# EAGLE design sensor (EAGLE 9.4.2)

## Sheet 1 of 2
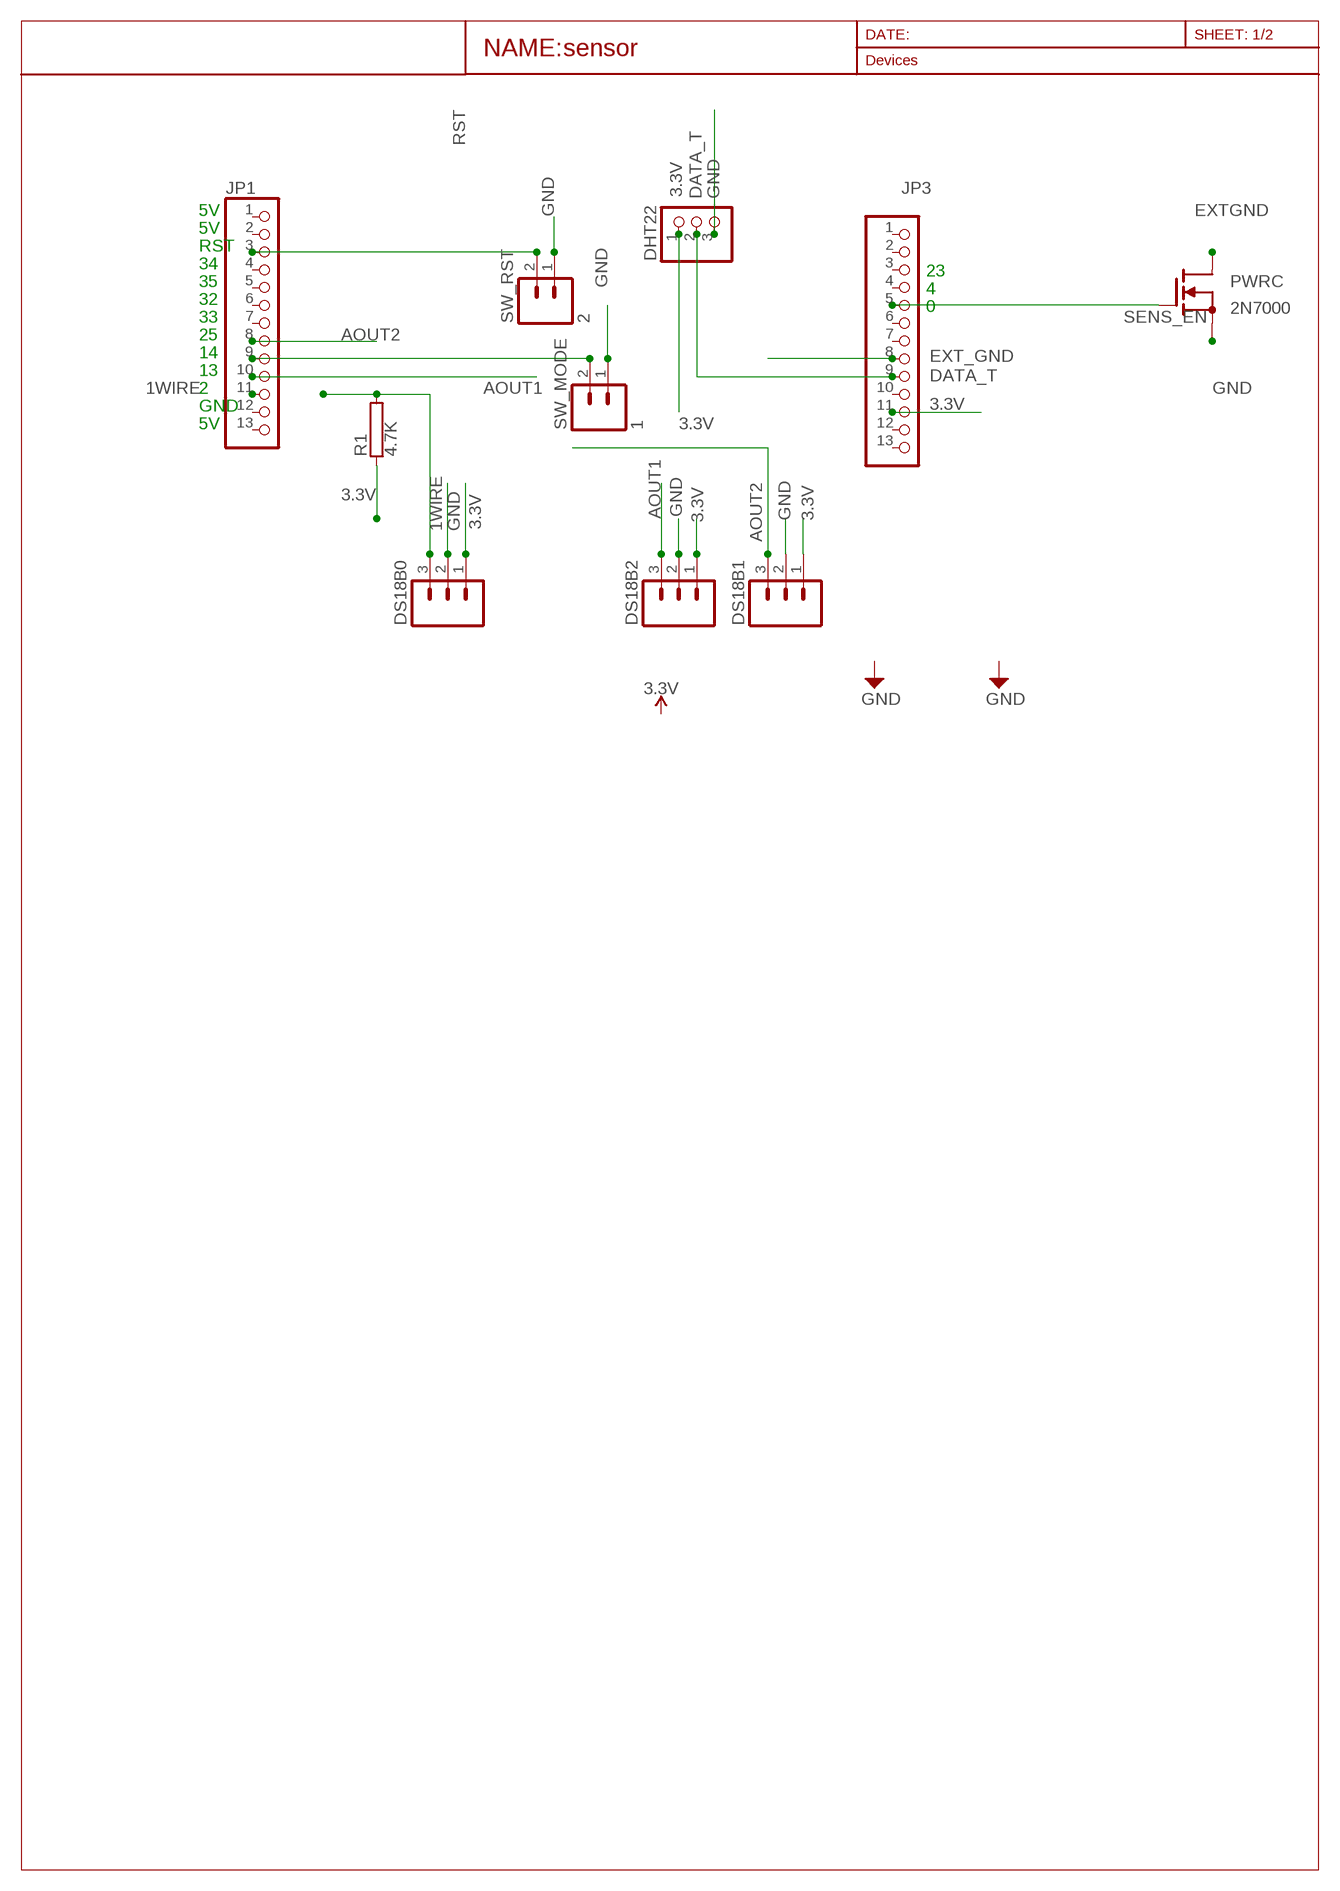
[diagram p0: schematic, sheet 1]

### Parts
DHT22  PINHD-1X3  [1X03]
DS18B0  M03  [03P]
DS18B1  M03  [03P]
DS18B2  M03  [03P]
JP1  PINHD-1X13  [1X13]
JP3  PINHD-1X13  [1X13]
PWRC  2N7000  [TO92]
R1  4.7K  RAC01  [AC01]
SW_MODE  1  M02  [02P]
SW_RST  2  M02  [02P]

### Nets
1WIRE: DS18B0.3 JP1.11 R1.2
3.3V: DHT22.1 DS18B0.1 DS18B1.1 DS18B2.1 JP3.11 R1.1
AOUT1: DS18B2.3 JP1.10
AOUT2: DS18B1.3 JP1.8
DATA_T: DHT22.2 JP3.9
EXT_GND: JP3.8
EXTGND: PWRC.E(D)
GND: DHT22.3 DS18B0.2 DS18B1.2 DS18B2.2 PWRC.C(S) SW_MODE.1 SW_RST.1
MODE: JP1.9 SW_MODE.2
RST: JP1.3 SW_RST.2
SENS_EN: JP3.5 PWRC.B(G)
Unconnected: JP1.1 JP1.2 JP1.4 JP1.5 JP1.6 JP1.7 JP1.12 JP1.13 JP3.1 JP3.2 JP3.3 JP3.4 JP3.6 JP3.7 JP3.10 JP3.12 JP3.13

### Notes on the sheet
- 5V
- 5V
- RST
- 34
- 23
- 35
- 4
- 32
- 0
- 33
- 25
- 14
- 13
- 2
- GND
- 5V

## Sheet 2 of 2

## Library data of the parts
DHT22 = adafruit:PINHD-1X3: PIN HEADER
DS18B0 DS18B1 DS18B2 = con-amp-quick:M03: AMP QUICK CONNECTOR; OC_FARNELL: unknown; OC_NEWARK: unknown
JP1 JP3 = adafruit:PINHD-1X13: PIN HEADER
PWRC = 2N7000:2N7000; AVAILABILITY: Unavailable; DESCRIPTION: MOSFETs- Power and Small Signal 60V 200mA N-Channel No-Cancel/No-Return; MF: STMicroelectronics; MP: 2N7000; PACKAGE: TO-92 ON Semiconductor; PRICE: None
R1 = resistor-power:R: Power Resitor; OC_FARNELL: unknown; OC_NEWARK: unknown
SW_MODE SW_RST = con-amp-quick:M02: AMP QUICK CONNECTOR; OC_FARNELL: unknown; OC_NEWARK: unknown

## Module SWITCHES
Ports: 

### Library data of the parts

## Module POWER
Ports: VCC(io) 3.3V(io) GND(io) ENABLE(io)

### Library data of the parts

## Board
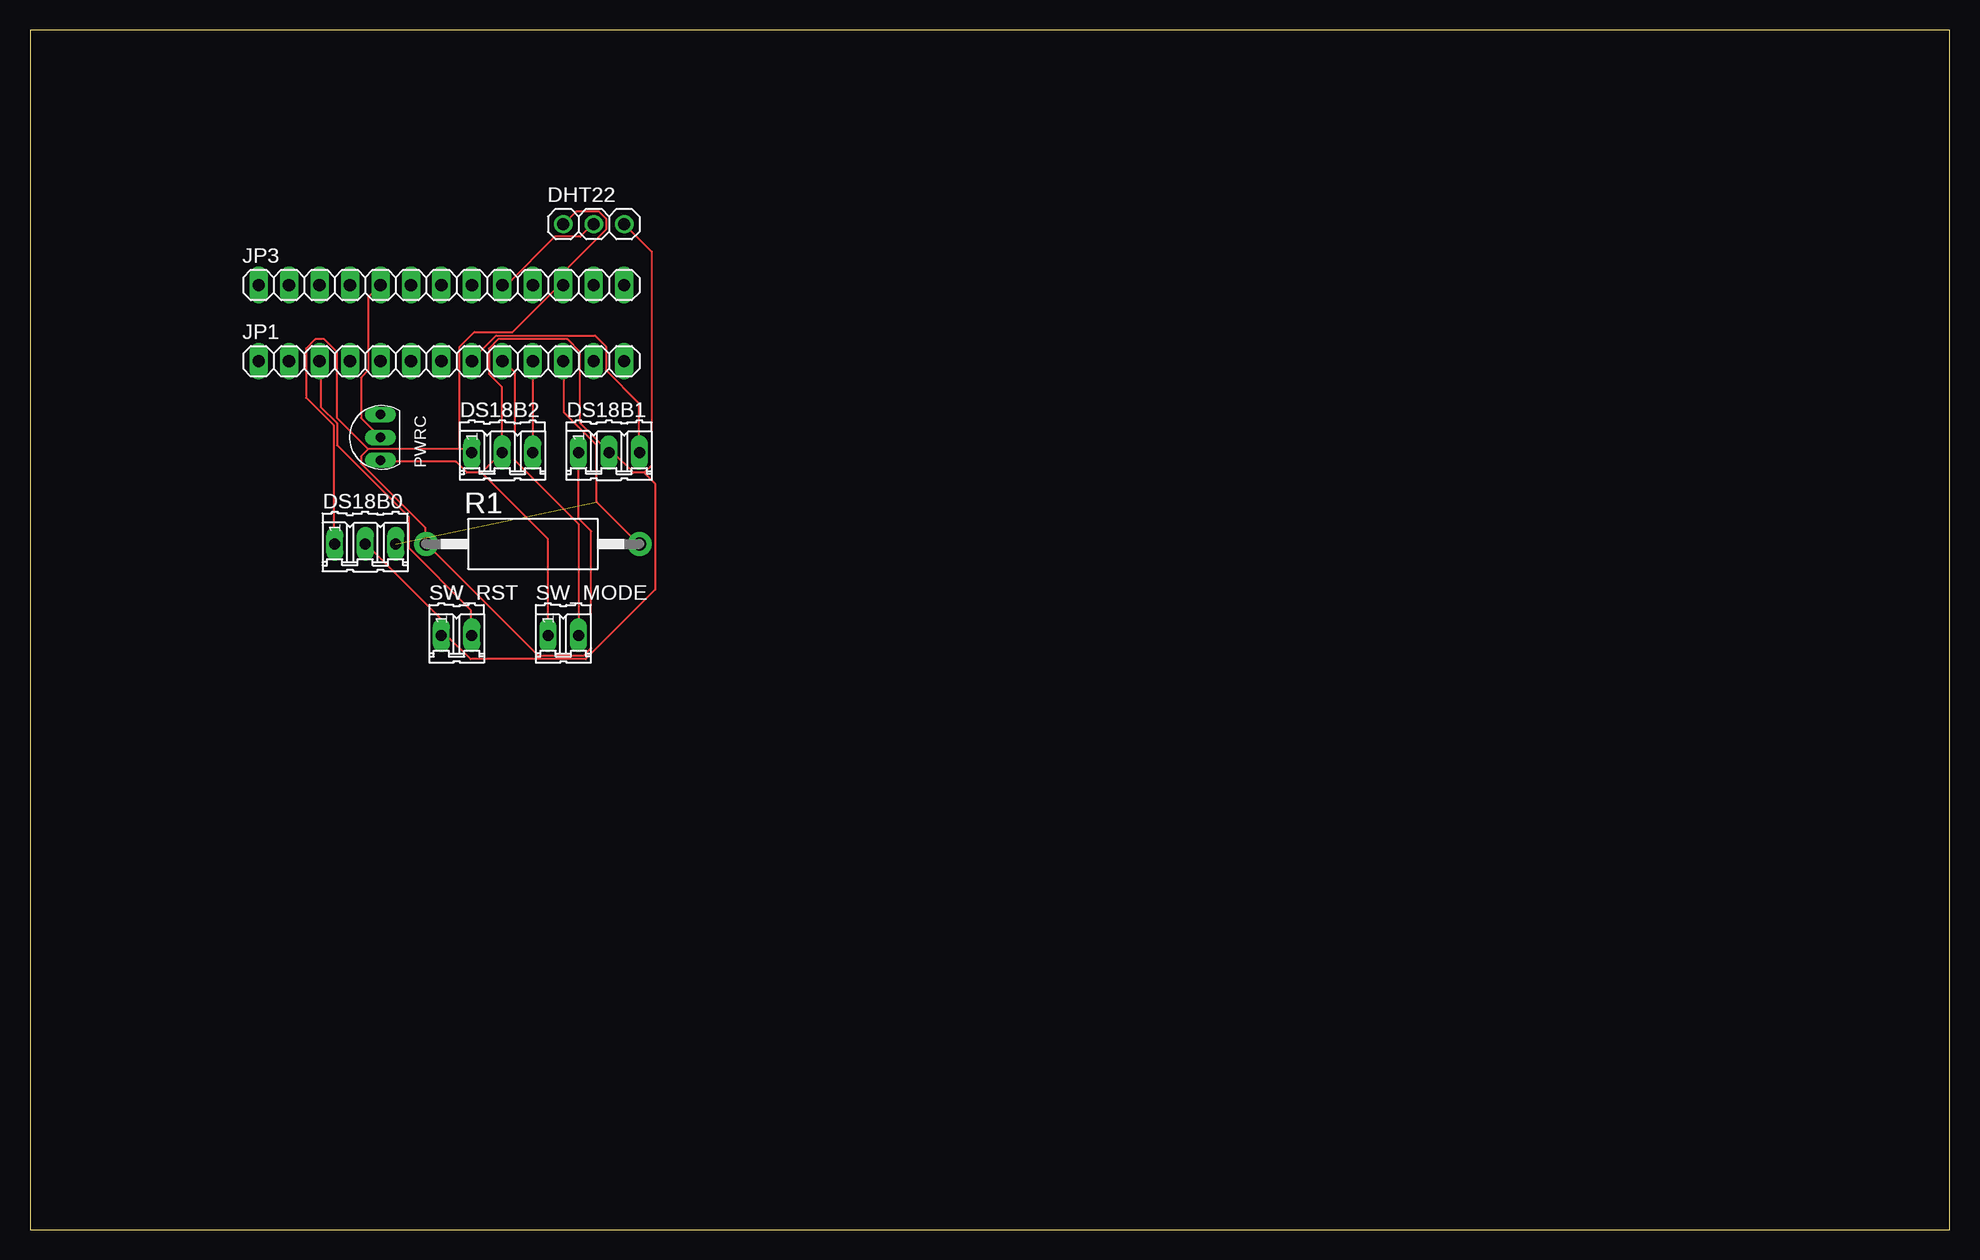
[diagram p1: board, top side]

Size 160 x 100 mm. Coordinates in mm from the lower left corner, seen from the top.
Outline: 0,0 160,0 160,100 0,100 0,0
Copper layers (1*16): Top 0.035mm / dielectric 1.5mm / Bottom 0.035mm
Design rules "default": minimum track width 6mil, minimum drill 0.35mm, track to track 6mil, track to pad 6mil, pad to pad 6mil, via to via 6mil, smd to smd 6mil, copper to edge 40mil, drill to drill 6mil, minimum pad ring 10mil, minimum via ring 8mil, stop-mask expansion 4mil, vias tented up to drill 0mil, thermal gap 10mil

### Footprints (pad centres in the part's own frame; a part is rotated, then mirrored left to right if it is on the bottom)
1X03 = drill 1.016: 1 -2.54,0; 2 0,0; 3 2.54,0
03P = drill 0.914 long: 1 -2.54,0; 2 0,0; 3 2.54,0
1X13 = drill 1.016 long: 1 -15.24,0; 2 -12.7,0; 3 -10.16,0; 4 -7.62,0; 5 -5.08,0; 6 -2.54,0; 7 0,0; 8 2.54,0; 9 5.08,0; 10 7.62,0; 11 10.16,0; 12 12.7,0; 13 15.24,0
TO92 = drill 0.8 pad 1.27 long: B 0,0; C 0,-1.905; E 0,1.905
AC01 = drill 1.1 pad 2: 1 -8.9,0; 2 8.9,0
02P = drill 0.914 long: 1 -1.27,0; 2 1.27,0

### Placement (x,y rotation side)
DHT22  46.99,83.82 0 top
DS18B0  27.94,57.15 0 top
DS18B1  48.26,64.77 0 top
DS18B2  39.37,64.77 0 top
JP1  34.29,72.39 0 top
JP3  34.29,78.74 0 top
PWRC  29.21,66.04 0 top
R1  41.91,57.15 0 top
SW_MODE  44.45,49.53 0 top
SW_RST  35.56,49.53 0 top

### Tracks (layer width: path | path; a pad name or v marks a point on that pad's centre or on a via)
1WIRE  (1 unrouted)
  Top 0.152: JP1.11 44.5,72.39 44.5,68.12 47.24,65.38 47.24,60.66 50.75,57.15 R1.2
3.3V
  Top 0.152: DS18B1.1 45.72,59.28 46.79,58.22 46.79,48.46 46.18,47.85 42.37,47.85 33.07,57.15 R1.1 32.92,57.15 32.92,58.52 27.58,63.86 27.58,64.47 28.19,65.08 | DHT22.1 44.5,83.82 45.57,84.89 47.4,84.89 48.01,84.28 48.01,83.36 44.5,79.86 44.5,78.79 JP3.11 44.35,78.64 44.04,78.64 40.23,74.83 37.03,74.83 35.81,73.61 35.81,65.08 | 28.19,65.08 25.6,67.67 25.6,73.15 24.54,74.22 23.77,74.22 23.01,73.46 23.01,69.34 25.3,67.06 25.3,57.15 DS18B0.1 | 35.81,65.08 36.42,65.08 36.73,64.77 DS18B2.1 | 35.81,65.08 28.19,65.08
AOUT1
  Top 0.152: JP1.10 DS18B2.3
AOUT2
  Top 0.152: DS18B1.3 50.75,64.77 50.75,68.89 48.01,71.63 48.01,73.61 47.09,74.52 38.86,74.52 36.73,72.39 JP1.8
DATA_T
  Top 0.152: JP3.9 39.47,78.79 39.78,78.79 43.74,82.75 45.87,82.75 46.94,83.82 DHT22.2
GND
  Top 0.152: 37.64,63.09 36.42,63.09 35.51,64.01 29.26,64.01 PWRC.C | 39.32,64.77 37.64,63.09 | 37.64,63.09 43.13,57.61 43.13,49.53 SW_MODE.1 | DS18B0.2 28.04,57.15 34.29,50.9 SW_RST.1 34.75,49.53 36.73,47.55 46.33,47.55 52.12,53.34 52.12,62.18 51.21,63.09 | 48.31,64.77 48.62,64.77 50.29,63.09 51.21,63.09 | 51.21,63.09 51.82,63.7 51.82,81.53 DHT22.3 | 39.32,64.77 39.32,70.26 38.25,71.32 38.25,73.46 39.01,74.22 44.81,74.22 45.87,73.15 45.87,67.21 48.31,64.77 | 39.32,64.77 DS18B2.2 | 48.31,64.77 DS18B1.2
MODE
  Top 0.152: SW_MODE.2 45.72,58.83 40.39,64.16 40.39,71.48 39.47,72.39 JP1.9
RST
  Top 0.152: SW_RST.2 36.73,49.53 36.73,51.66 31.55,56.84 31.55,59.44 25.6,65.38 25.6,67.21 24.23,68.58 24.23,72.39 JP1.3
SENS_EN
  Top 0.152: PWRC.B 27.58,67.67 27.58,71.02 28.19,71.63 28.19,77.72 JP3.5

### Text on the board
_tNames: DHT22 | JP3 | JP1 | DS18B2 | DS18B1 | PWRC | DS18B0 | R1 | SW_RST | SW_MODE